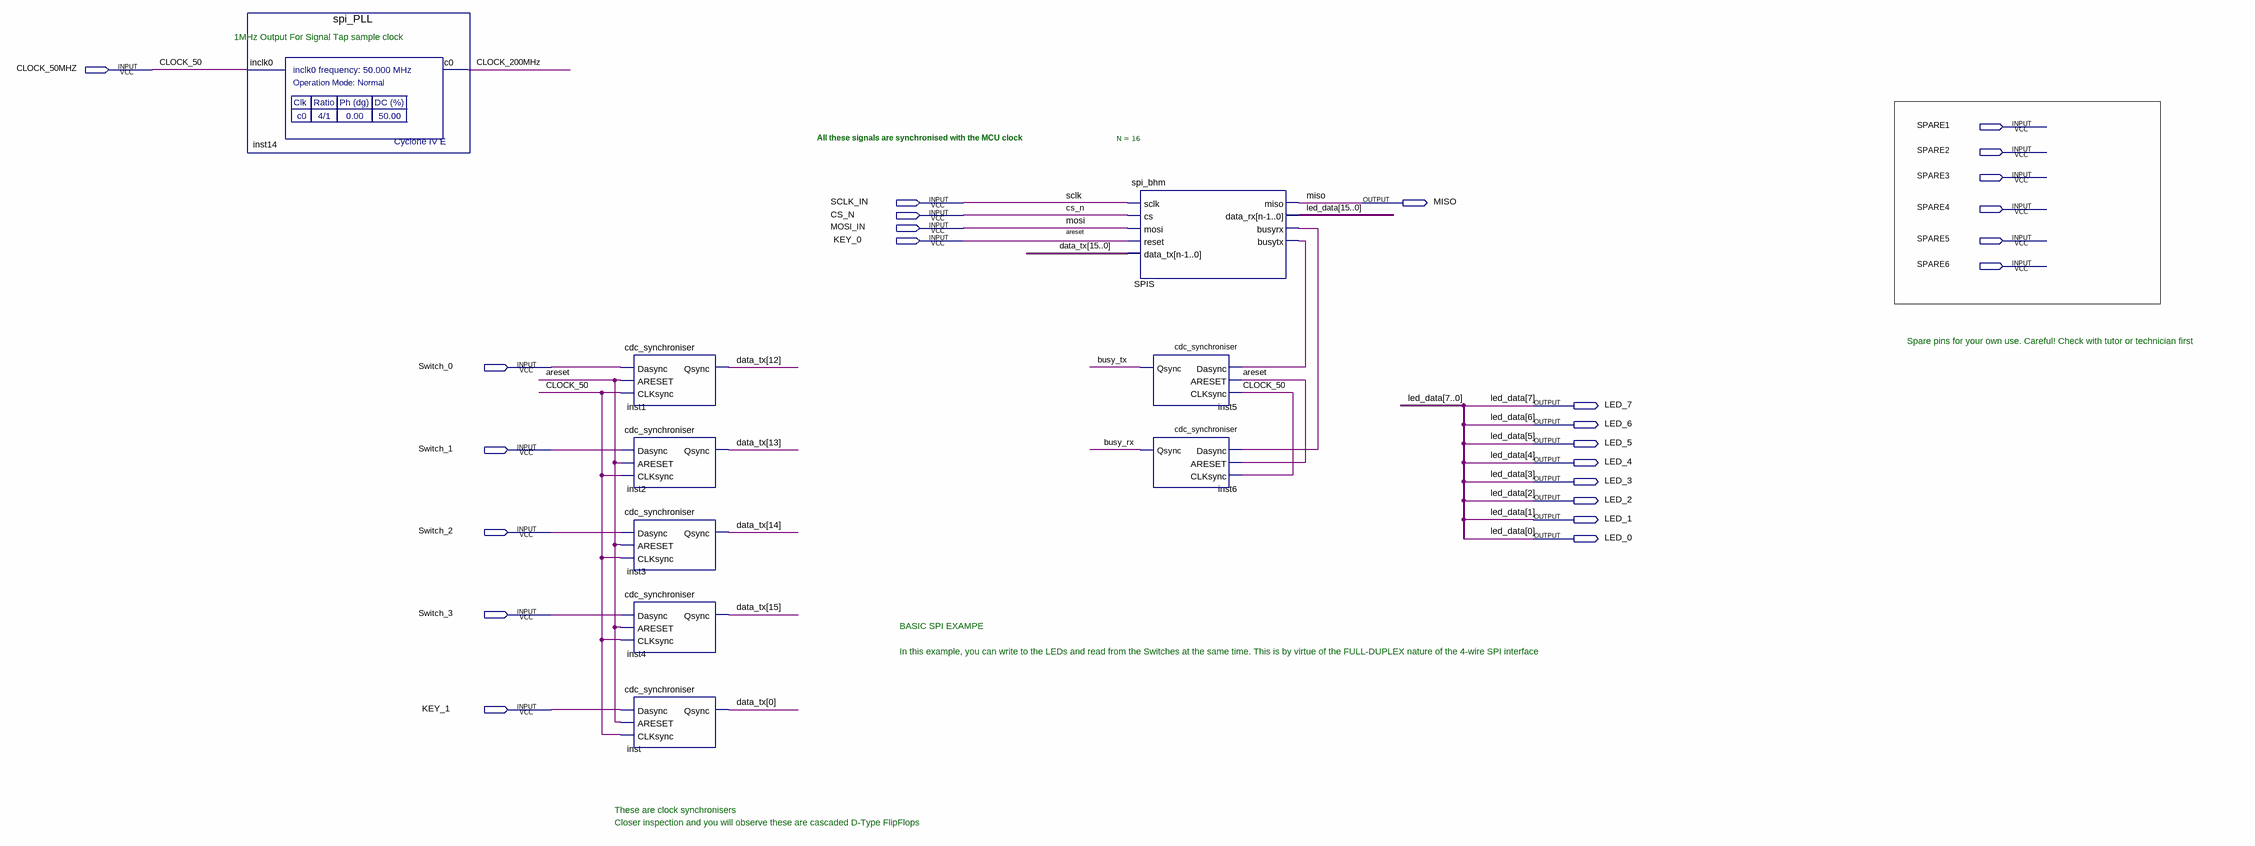
[diagram p0: schematic sheet]
// Quartus schematic spi_test.bdf as structural Verilog: 9 symbols, 25 pins
module spi_test (
  input  CLOCK_50MHZ,
  input  SPARE1,
  input  SPARE2,
  input  SPARE3,
  input  SCLK_IN,
  input  SPARE4,
  input  CS_N,
  input  MOSI_IN,
  input  KEY_0,
  input  SPARE5,
  input  SPARE6,
  input  Switch_0,
  input  Switch_1,
  input  Switch_2,
  input  Switch_3,
  input  KEY_1,
  output MISO,
  output LED_7,
  output LED_6,
  output LED_5,
  output LED_4,
  output LED_3,
  output LED_2,
  output LED_1,
  output LED_0
);

  wire busy_rx, busy_tx, CLOCK_200MHz, SPIS_busyrx, SPIS_busytx;
  wire [15:0] data_tx;
  wire [15:8] led_data;

  spi_PLL inst14 (.inclk0(CLOCK_50MHZ), .c0(CLOCK_200MHz));
  cdc_synchroniser inst1 (.Dasync(Switch_0), .ARESET(KEY_0), .CLKsync(CLOCK_50MHZ), .Qsync(data_tx[12]));
  cdc_synchroniser inst2 (.Dasync(Switch_1), .ARESET(KEY_0), .CLKsync(CLOCK_50MHZ), .Qsync(data_tx[13]));
  cdc_synchroniser inst3 (.Dasync(Switch_2), .ARESET(KEY_0), .CLKsync(CLOCK_50MHZ), .Qsync(data_tx[14]));
  cdc_synchroniser inst4 (.Dasync(Switch_3), .ARESET(KEY_0), .CLKsync(CLOCK_50MHZ), .Qsync(data_tx[15]));
  cdc_synchroniser inst (.Dasync(KEY_1), .ARESET(KEY_0), .CLKsync(CLOCK_50MHZ), .Qsync(data_tx[0]));
  spi_bhm #(.N(16)) SPIS (
    .sclk(SCLK_IN), .cs(CS_N), .mosi(MOSI_IN), .reset(KEY_0), .data_tx(data_tx), .miso(MISO),
    .data_rx({led_data, LED_7, LED_6, LED_5, LED_4, LED_3, LED_2, LED_1, LED_0}), .busyrx(SPIS_busyrx),
    .busytx(SPIS_busytx));
  cdc_synchroniser inst5 (.Dasync(SPIS_busytx), .ARESET(KEY_0), .CLKsync(CLOCK_50MHZ), .Qsync(busy_tx));
  cdc_synchroniser inst6 (.Dasync(SPIS_busyrx), .ARESET(KEY_0), .CLKsync(CLOCK_50MHZ), .Qsync(busy_rx));

  // Other names for the same wires on the sheet: areset = KEY_0; CLOCK_50 = CLOCK_50MHZ;
  //   led_data[7:0] = {LED_7, LED_6, LED_5, LED_4, LED_3, LED_2, LED_1, LED_0}; mosi = MOSI_IN; sclk = SCLK_IN

  // Notes on the sheet:
  //   1MHz Output For Signal Tap sample clock
  //   All these signals are synchronised with the MCU clock
  //   Spare pins for your own use. Careful! Check with tutor or technician first 
  //   BASIC SPI EXAMPE
  //   In this example, you can write to the LEDs and read from the Switches at the same time. This is by virtue of the FULL-DUPLEX nature of the 4-wire SPI interface
  //   These are clock synchronisers
  //   Closer inspection and you will observe these are cascaded D-Type FlipFlops
endmodule
